# Altium schematic sheet LoopDriver.SchDoc
size B; CompanyName: Microchip Technology Inc.; Organization: Microchip Technology; Address1: 2355 West Chandler Blvd.; Address2: Chandler, AZ  85224; Address4: USA; SheetNumber: 2; SheetTotal: 4; SheetTitle: **; Time: Time
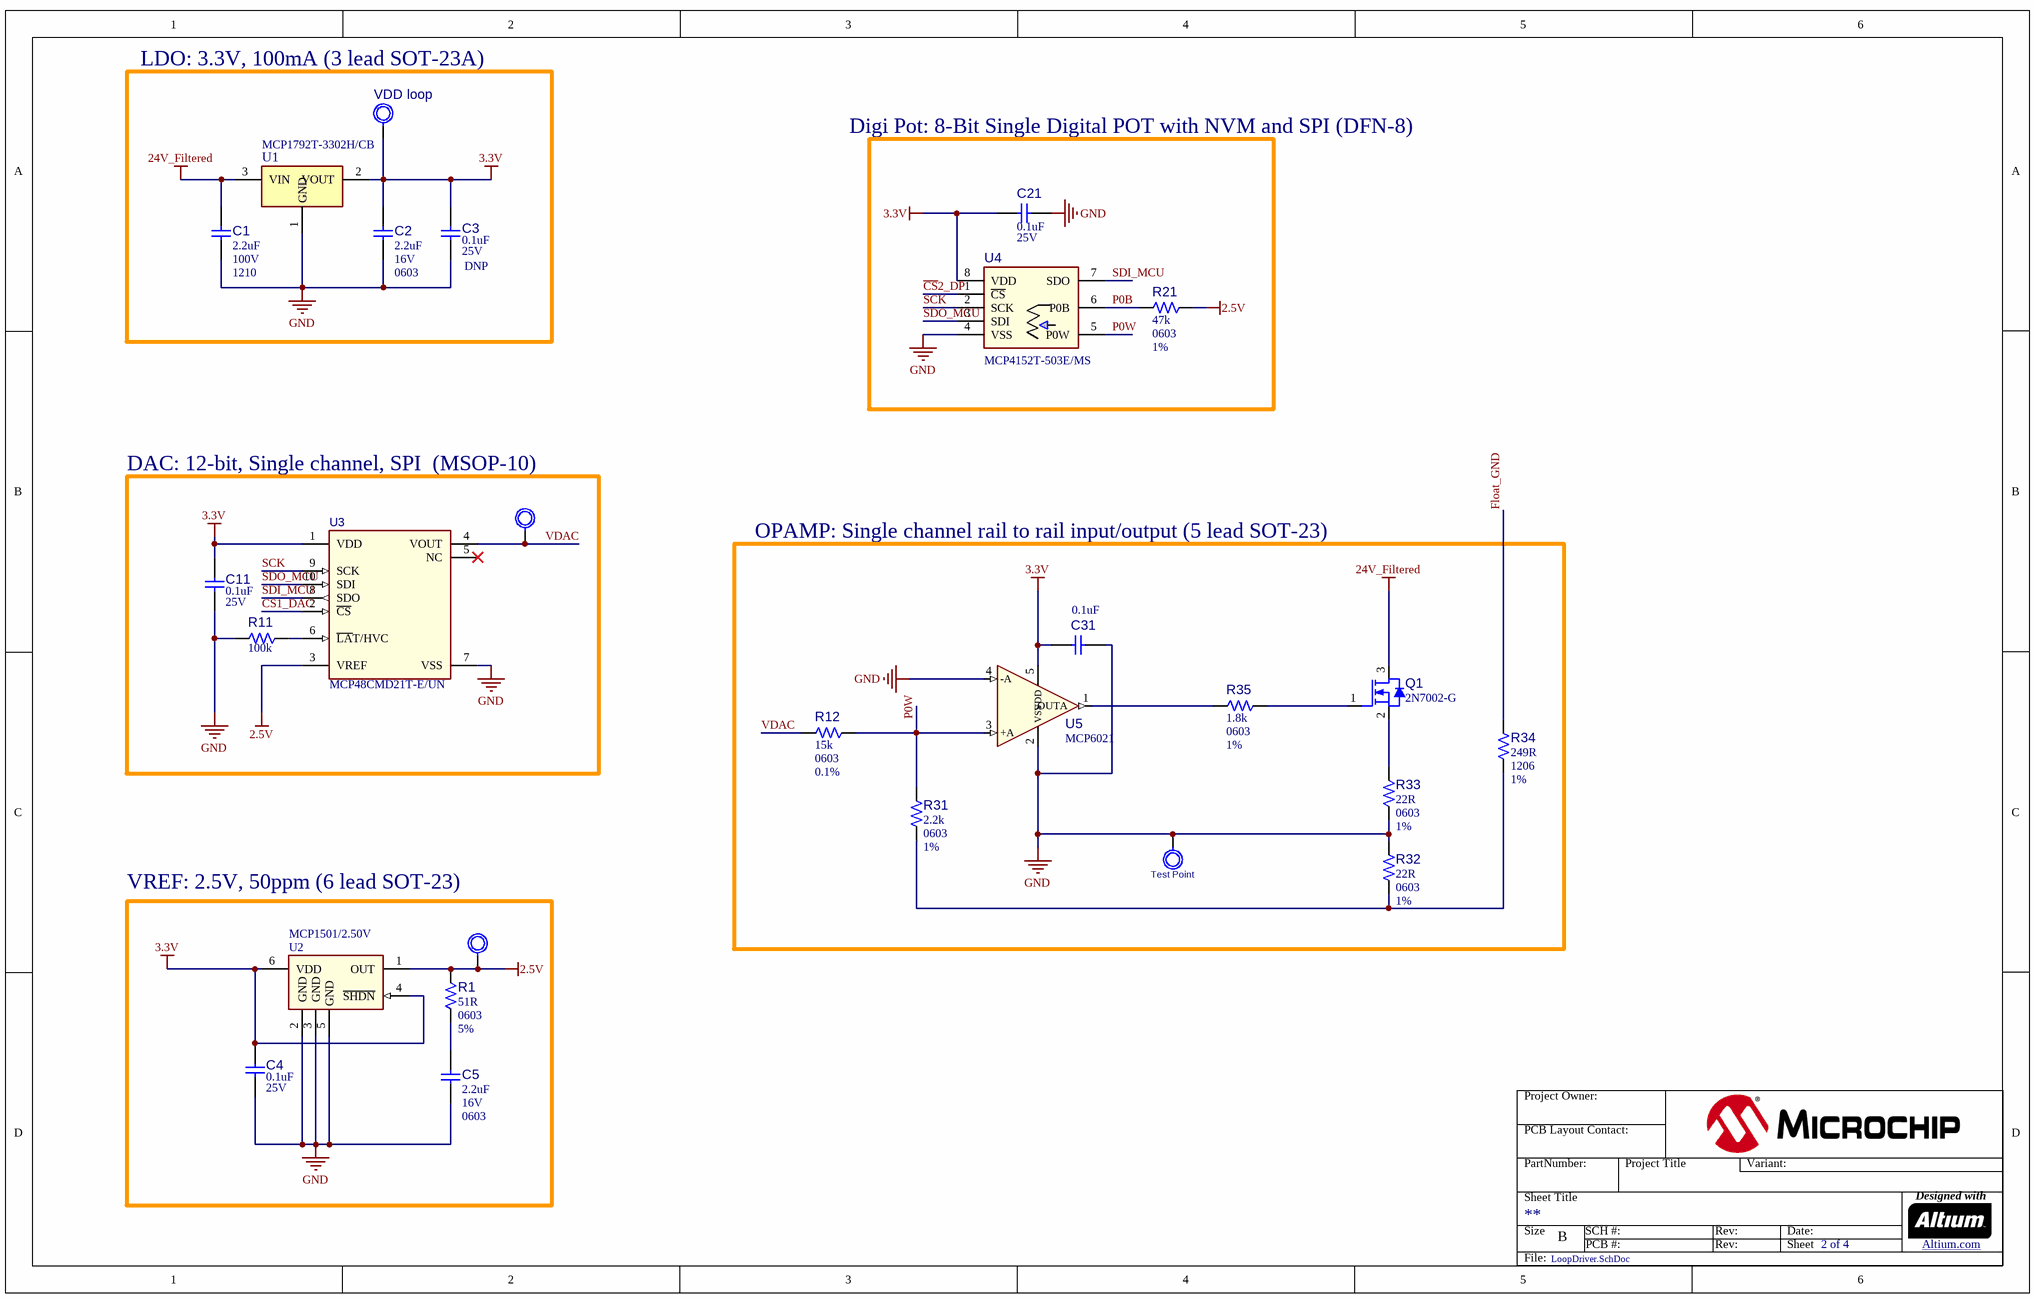
[diagram p0: LoopDriver.SchDoc]

## Parts
C1  value 2.2uF  Voltage: 100V  Package: 1210  [CAP_C_1210]
C2  value 2.2uF  Voltage: 16V  Package: 0603  [CAP_C_0603]
C3  value 0.1uF  Voltage: 25V  Populated: DNP  [CAP_C_0603]
C4  value 0.1uF  Voltage: 25V  [CAP_C_0603]
C5  value 2.2uF  Voltage: 16V  Package: 0603  [CAP_C_0603]
C11  value 0.1uF  Voltage: 25V  [CAP_C_0603]
C21  value 0.1uF  Voltage: 25V  [CAP_C_0603]
C31  value 0.1uF  [CAP_C_0603]
GND  Test Point  [CON_TP_TH_V_BLK_KEC_5011]
Q1  value 2N7002-G  [SOT-23-3]
R1  value 51R  Package: 0603  Tolerance: 5%  [RES_C_0603]
R11  value 100k  [RES_C_0603]
R12  value 15k  Package: 0603  Tolerance: 0.1%  [RES_C_0603]
R21  value 47k  Package: 0603  Tolerance: 1%  [RES_C_0603]
R31  value 2.2k  Package: 0603  Tolerance: 1%  [RES_C_0603]
R32  value 22R  Package: 0603  Tolerance: 1%  [RES_C_0603]
R33  value 22R  Package: 0603  Tolerance: 1%  [RES_C_0603]
R34  value 249R  Package: 1206  Tolerance: 1%  [RES_C_1206]
R35  value 1.8k  Package: 0603  Tolerance: 1%  [RES_C_0603]
U1  value MCP1792T-3302H/CB  [SOT-23A-3]
U2  value MCP1501/2.50V  [SOT-23-6]
U3  value MCP48CMD21T-E/UN  [MSOP-10]
U4  value MCP4152T-503E/MS  [MSOP-8]
U5  value MCP6021  [SOT-23-5]
VDAC  (no value)  [CON_TP_TH_V_RED_KEC_5010]
VDD_loop  (no value)  [CON_TP_TH_V_RED_KEC_5010]
VREF  (no value)  [CON_TP_TH_V_RED_KEC_5010]

## Nets
2.5V: R1.2 R21.1 U2.1(OUT) U3.3(VREF) VREF.1
3.3V: C2.2 C3.2 C4.1 C11.1 C21.2 C31.1 U1.2(VOUT) U2.4(~{SHDN}) U2.6(VDD) U3.1(VDD) U4.8(VDD) U5.5(VDD) VDD_loop.1
24V_Filtered: C1.2 Q1.3(D) U1.3(VIN)
GND: C1.1 C2.1 C3.1 C4.2 C5.1 C11.2 C21.1 C31.2 GND.1 R11.1 R32.2 R33.1 U1.1(GND) U2.2(GND) U2.3(GND) U2.5(GND) U3.7(VSS) U4.4(VSS) U5.2(VSS) U5.4(-A)
~{CS}1_DAC: U3.2(~{CS})
~{CS}2_DP: U4.1(~{CS})
Float_GND: R34.2
P0B: R21.2 U4.6(P0B)
P0W: R12.2 R31.2 U4.5(P0W) U5.3(+A)
SCK: U3.9(SCK) U4.2(SCK)
SDI_MCU: U3.8(SDO) U4.7(SDO)
SDO_MCU: U3.10(SDI) U4.3(SDI)
VDAC: R12.1 U3.4(VOUT) VDAC.1
NetC5_2: C5.2 R1.1
NetQ1_1: Q1.1(G) R35.2
NetQ1_2: Q1.2(S) R33.2
NetR11_2: R11.2 U3.6(~{LA}T/HVC)
NetR31_1: R31.1 R32.1 R34.1
NetR35_1: R35.1 U5.1(OUTA)

Not connected (* = marked no-connect by the designer): U3 5(NC)*

## Notes on the sheet
- LDO: 3.3V, 100mA (3 lead SOT-23A)
- Digi Pot: 8-Bit Single Digital POT with NVM and SPI (DFN-8)
- DAC: 12-bit, Single channel, SPI  (MSOP-10)
- OPAMP: Single channel rail to rail input/output (5 lead SOT-23)
- VREF: 2.5V, 50ppm (6 lead SOT-23)
- Project Owner:
- PCB Layout Contact:
- PartNumber:
- Project Title
- Variant:
- Sheet Title
- Size
- B
- SCH #:
- PCB #:
- Rev:
- Date:
- Sheet
- Designed with
- Altium.com <http://go.altium.com/MicrochipLandingPage_Evaluation.html>
- File:

## Library data of the parts
C1 = CAP2314: Manufacturer 1: Samsung Electro-Mechanics; Manufacturer Part Number 1: CL32B225KCJSNNE; Description_: CAP CER 2.2uF 100V 10% X7R SMD 1210; Dev Tools Status: Production; Tolerance: 10%; Temperature Coefficient: X7R; Type: Ceramic; Owner: Narasimha Murthy; Populated: YES; MCHP-ID: CAP2314; Revision: 3; Symbol: Capacitor NP; Status: MCL Design; ComponentLink1URL: https://chn-vm-apps.microchip.com/mchprepo/parts/Datasheets/CL_Series_MLCC_ds.pdf; ComponentLink1Description: SVN Datasheet; ComponentLink2URL: C:\ALTIUM_WORK\00001_MCHP-CDB\Datasheets\CL_Series_MLCC_ds.pdf; ComponentLink2Description: Local Datasheet; ComponentLink3URL: C:\ALTIUM_WORK\00001_MCHP-CDB\Library\LibraryRefs\Capacitor NP.SchLib; ComponentLink3Description: Open Symbol; ComponentLink4URL: C:\ALTIUM_WORK\00001_MCHP-CDB\Library\Footprints\CAP_C_1210.PcbLib; ComponentLink4Description: Open Footprint; ComponentLink5Description: Open Footprint 2; ComponentLink6Description: Open Footprint 3; ComponentLink7Description: Open Footprint 4; Operating Temperature: -55C to +125C; Category: Capacitor; Manufacturer 2: TDK Corporation; Manufacturer Part Number 2: C3225X7R2A225K230AB; Supplier 1: Digi-Key; Supplier Part Number 1: 1276-3362-1-ND; Supplier 2: Digi-Key; Supplier Part Number 2: 445-4497-1-ND; Quantity Override: 1
C2 C5 = CAP0597: Manufacturer 1: TDK Corporation; Manufacturer Part Number 1: C1608X5R1C225K080AB; Description_: CAP CER 2.2uF 16V 10% X5R SMD 0603; Dev Tools Status: Production; Tolerance: 10%; Temperature Coefficient: X5R; Type: Ceramic; Populated: Yes; MCHP-ID: CAP0597; Revision: 6; Symbol: Capacitor NP; Status: MCL Design; ComponentLink1URL: https://chn-vm-apps.microchip.com/mchprepo/parts/Datasheets/general_B11.pdf; ComponentLink1Description: SVN Datasheet; ComponentLink2URL: C:\ALTIUM_WORK\00001_MCHP-CDB\Datasheets\general_B11.pdf; ComponentLink2Description: Local Datasheet; ComponentLink3URL: C:\ALTIUM_WORK\00001_MCHP-CDB\Library\LibraryRefs\Capacitor NP.SchLib; ComponentLink3Description: Open Symbol; ComponentLink4URL: C:\ALTIUM_WORK\00001_MCHP-CDB\Library\Footprints\CAP_C_0603.PcbLib; ComponentLink4Description: Open Footprint; ComponentLink5Description: Open Footprint 2; ComponentLink6Description: Open Footprint 3; ComponentLink7Description: Open Footprint 4; Operating Temperature: -55C to +85C; Category: Capacitor; Supplier 1: Digi-Key; Supplier Part Number 1: 445-5157-1-ND; Quantity Override: 1
C3 = CAP2605: Manufacturer 1: KEMET; Manufacturer Part Number 1: C0603C104K3RAC7013; Description_: CAP CER 0.1uF 25V 10% X7R SMD 0603; Dev Tools Status: Production; Tolerance: 10%; Type: Ceramic; Owner: Cristina Salanti; Temperature Coefficient: X7R; Restricted Sourcing: No; MCHP-ID: CAP2605; Package: 0603; Revision: 1; Symbol: Capacitor NP; Status: MCL Design; ComponentLink1URL: https://chn-vm-apps.microchip.com/mchprepo/parts/Datasheets/KEM_C1002_X7R_SMD.pdf; ComponentLink1Description: SVN Datasheet; ComponentLink2URL: C:\ALTIUM_WORK\00001_MCHP-CDB\Datasheets\KEM_C1002_X7R_SMD.pdf; ComponentLink2Description: Local Datasheet; ComponentLink3URL: C:\ALTIUM_WORK\00001_MCHP-CDB\Library\LibraryRefs\Capacitor NP.SchLib; ComponentLink3Description: Open Symbol; ComponentLink4URL: C:\ALTIUM_WORK\00001_MCHP-CDB\Library\Footprints\CAP_C_0603.PcbLib; ComponentLink4Description: Open Footprint; ComponentLink5Description: Open Footprint 2; ComponentLink6Description: Open Footprint 3; ComponentLink7Description: Open Footprint 4; Operating Temperature: -55C to +125C; Category: Capacitor; Manufacturer 2: KYOCERA AVX; Manufacturer Part Number 2: 06033C104KAZ2A; Manufacturer 3: KYOCERA AVX; Manufacturer Part Number 3: 06033C104KAT4A; Manufacturer 4: Samsung Electro-Mechanics; Manufacturer Part Number 4: CL10B104KA8NNNC; Supplier 1: Digi-Key; Supplier Part Number 1: 399-17572-2-ND; Supplier 2: Digi-Key; Supplier Part Number 2: 478-3539-2-ND; Supplier 3: Digi-Key; Supplier Part Number 3: 478-7018-2-ND; Supplier 4: Digi-Key; Supplier Part Number 4: 1276-1006-2-ND; Quantity Override: 1; Manufacturer 5: TDK Corporation; Manufacturer Part Number 5: CGA3E2X7R1E104K080AA; Manufacturer 6: Walsin; Manufacturer Part Number 6: 0603B104K250CT; Supplier 5: Digi-Key; Supplier Part Number 5: 445-5667-2-ND; Supplier 6: Digi-Key; Supplier Part Number 6: 1292-1642-2-ND
C4 C11 C21 = CAP2605: Manufacturer 1: KEMET; Manufacturer Part Number 1: C0603C104K3RAC7013; Description_: CAP CER 0.1uF 25V 10% X7R SMD 0603; Dev Tools Status: Production; Tolerance: 10%; Type: Ceramic; Owner: Cristina Salanti; Populated: YES; Temperature Coefficient: X7R; Restricted Sourcing: No; MCHP-ID: CAP2605; Package: 0603; Revision: 1; Symbol: Capacitor NP; Status: MCL Design; ComponentLink1URL: https://chn-vm-apps.microchip.com/mchprepo/parts/Datasheets/KEM_C1002_X7R_SMD.pdf; ComponentLink1Description: SVN Datasheet; ComponentLink2URL: C:\ALTIUM_WORK\00001_MCHP-CDB\Datasheets\KEM_C1002_X7R_SMD.pdf; ComponentLink2Description: Local Datasheet; ComponentLink3URL: C:\ALTIUM_WORK\00001_MCHP-CDB\Library\LibraryRefs\Capacitor NP.SchLib; ComponentLink3Description: Open Symbol; ComponentLink4URL: C:\ALTIUM_WORK\00001_MCHP-CDB\Library\Footprints\CAP_C_0603.PcbLib; ComponentLink4Description: Open Footprint; ComponentLink5Description: Open Footprint 2; ComponentLink6Description: Open Footprint 3; ComponentLink7Description: Open Footprint 4; Operating Temperature: -55C to +125C; Category: Capacitor; Manufacturer 2: KYOCERA AVX; Manufacturer Part Number 2: 06033C104KAZ2A; Manufacturer 3: KYOCERA AVX; Manufacturer Part Number 3: 06033C104KAT4A; Manufacturer 4: Samsung Electro-Mechanics; Manufacturer Part Number 4: CL10B104KA8NNNC; Supplier 1: Digi-Key; Supplier Part Number 1: 399-17572-2-ND; Supplier 2: Digi-Key; Supplier Part Number 2: 478-3539-2-ND; Supplier 3: Digi-Key; Supplier Part Number 3: 478-7018-2-ND; Supplier 4: Digi-Key; Supplier Part Number 4: 1276-1006-2-ND; Quantity Override: 1; Manufacturer 5: TDK Corporation; Manufacturer Part Number 5: CGA3E2X7R1E104K080AA; Manufacturer 6: Walsin; Manufacturer Part Number 6: 0603B104K250CT; Supplier 5: Digi-Key; Supplier Part Number 5: 445-5667-2-ND; Supplier 6: Digi-Key; Supplier Part Number 6: 1292-1642-2-ND
C31 = CAP2605: Manufacturer 1: KEMET; Manufacturer Part Number 1: C0603C104K3RAC7013; Voltage: 25V; Description_: CAP CER 0.1uF 25V 10% X7R SMD 0603; Dev Tools Status: Production; Tolerance: 10%; Type: Ceramic; Owner: Cristina Salanti; Populated: YES; Temperature Coefficient: X7R; Restricted Sourcing: No; MCHP-ID: CAP2605; Package: 0603; Revision: 1; Symbol: Capacitor NP; Status: MCL Design; ComponentLink1URL: https://chn-vm-apps.microchip.com/mchprepo/parts/Datasheets/KEM_C1002_X7R_SMD.pdf; ComponentLink1Description: SVN Datasheet; ComponentLink2URL: C:\ALTIUM_WORK\00001_MCHP-CDB\Datasheets\KEM_C1002_X7R_SMD.pdf; ComponentLink2Description: Local Datasheet; ComponentLink3URL: C:\ALTIUM_WORK\00001_MCHP-CDB\Library\LibraryRefs\Capacitor NP.SchLib; ComponentLink3Description: Open Symbol; ComponentLink4URL: C:\ALTIUM_WORK\00001_MCHP-CDB\Library\Footprints\CAP_C_0603.PcbLib; ComponentLink4Description: Open Footprint; ComponentLink5Description: Open Footprint 2; ComponentLink6Description: Open Footprint 3; ComponentLink7Description: Open Footprint 4; Operating Temperature: -55C to +125C; Category: Capacitor; Manufacturer 2: KYOCERA AVX; Manufacturer Part Number 2: 06033C104KAZ2A; Manufacturer 3: KYOCERA AVX; Manufacturer Part Number 3: 06033C104KAT4A; Manufacturer 4: Samsung Electro-Mechanics; Manufacturer Part Number 4: CL10B104KA8NNNC; Supplier 1: Digi-Key; Supplier Part Number 1: 399-17572-2-ND; Supplier 2: Digi-Key; Supplier Part Number 2: 478-3539-2-ND; Supplier 3: Digi-Key; Supplier Part Number 3: 478-7018-2-ND; Supplier 4: Digi-Key; Supplier Part Number 4: 1276-1006-2-ND; Quantity Override: 1; Manufacturer 5: TDK Corporation; Manufacturer Part Number 5: CGA3E2X7R1E104K080AA; Manufacturer 6: Walsin; Manufacturer Part Number 6: 0603B104K250CT; Supplier 5: Digi-Key; Supplier Part Number 5: 445-5667-2-ND; Supplier 6: Digi-Key; Supplier Part Number 6: 1292-1642-2-ND
GND = MISC0025: Manufacturer 1: Keystone; Manufacturer Part Number 1: 5011; Value: TP LOOP Black TH; Description_: CON TP LOOP Black TH; Dev Tools Status: Production; Owner: Tad Ahlvers; Populated: YES; Restricted Sourcing: No; MCHP-ID: MISC0025; Revision: 3; Symbol: Test Point; Status: MCL Design; ComponentLink1URL: https://chn-vm-apps.microchip.com/mchprepo/parts/Datasheets/M60-2p60.pdf; ComponentLink1Description: SVN Datasheet; ComponentLink2URL: C:\ALTIUM_WORK\00001_MCHP-CDB\Datasheets\M60-2p60.pdf; ComponentLink2Description: Local Datasheet; ComponentLink3URL: C:\ALTIUM_WORK\00001_MCHP-CDB\Library\LibraryRefs\Test Point.SchLib; ComponentLink3Description: Open Symbol; ComponentLink4URL: C:\ALTIUM_WORK\00001_MCHP-CDB\Library\Footprints\CON_TP_TH_V_BLK_KEC_5011.PcbLib; ComponentLink4Description: Open Footprint; ComponentLink5Description: Open Footprint 2; ComponentLink6Description: Open Footprint 3; ComponentLink7Description: Open Footprint 4; Type: Test Point; Category: Connector; Manufacturer 2: FuZhou XiXiang Electronic Technology; Manufacturer Part Number 2: Test Point-1P-DIP-H8.1-Ф3.2-BLACK; Supplier 1: Digi-Key; Supplier Part Number 1: 36-5011-ND; Supplier 2: FuZhou XiXiang Electronic Technology; Supplier Part Number 2: Test Point-1P-DIP-H8.1-Ф3.2-BLACK; Quantity Override: 1
Q1 = MIC7247: Transistor MOS; Manufacturer 1: Microchip Technology; Description_: MCHP ANALOG MOSFET N-CH 2N7002-G 60V 115mA SOT-23-3; Type: MOSFET; Dev Tools Status: Production; Owner: Mark Loper; Populated: YES; MCHP-ID: MIC7247; Symbol: Transistor MOS-N GSD; Status: MCL Design; Revision: 2; Category: MCHP-Analog; ComponentLink1URL: https://chn-vm-apps.microchip.com/mchprepo/parts/Datasheets/2N7002.pdf; ComponentLink1Description: SVN Datasheet; ComponentLink2URL: C:\ALTIUM_WORK\00001_MCHP-CDB\Datasheets\2N7002.pdf; ComponentLink2Description: Local Datasheet; ComponentLink3URL: C:\ALTIUM_WORK\00001_MCHP-CDB\Library\LibraryRefs\Transistor MOS-N GSD.SchLib; ComponentLink3Description: Open Symbol; ComponentLink4URL: C:\ALTIUM_WORK\00001_MCHP-CDB\Library\Footprints\SOT-23-3.PcbLib; ComponentLink4Description: Open Footprint; ComponentLink5Description: Open Footprint 2; ComponentLink6Description: Open Footprint 3; ComponentLink7Description: Open Footprint 4; Manufacturer Part Number 1: 2N7002-G; Supplier 1: Digi-Key; Supplier Part Number 1: 2N7002-GMCCT-ND; Operating Temperature: -55C to +150C; Quantity Override: 1
R1 = RSMT0347: Resistor; Manufacturer 1: Panasonic; Manufacturer Part Number 1: ERJ-3GEYJ510V; Description_: RES TKF 51R 5% 1/10W SMD 0603; Dev Tools Status: Production; Temperature Coefficient: 200ppm/C; Power: 1/10W; Populated: Yes; MCHP-ID: RSMT0347; Revision: 1; Symbol: Resistor; Status: MCL Design; ComponentLink1URL: https://chn-vm-apps.microchip.com/mchprepo/parts/Datasheets/nrc.pdf; ComponentLink1Description: SVN Datasheet; ComponentLink2URL: C:\ALTIUM_WORK\00001_MCHP-CDB\Datasheets\nrc.pdf; ComponentLink2Description: Local Datasheet; ComponentLink3URL: C:\ALTIUM_WORK\00001_MCHP-CDB\Library\LibraryRefs\Resistor.SchLib; ComponentLink3Description: Open Symbol; ComponentLink4URL: C:\ALTIUM_WORK\00001_MCHP-CDB\Library\Footprints\RES_C_0603.PcbLib; ComponentLink4Description: Open Footprint; ComponentLink5Description: Open Footprint 2; ComponentLink6Description: Open Footprint 3; ComponentLink7Description: Open Footprint 4; Operating Temperature: -55C to +155C; Category: Resistor; Type: RES SMD; Composition: TKF; Manufacturer 2: NIC Components; Manufacturer Part Number 2: NRC06J510TRF; Manufacturer 3: Stackpole Electronics Inc; Manufacturer Part Number 3: RMCF1/16515%R; Supplier 1: Digi-Key; Supplier Part Number 1: P51GCT-ND; Supplier 2: NIC Components; Supplier Part Number 2: NRC06J510TRF; Supplier 3: Stackpole Electronics Inc; Supplier Part Number 3: RMCF1/16515%R; Quantity Override: 1
R11 = RSMT0026: Resistor; Manufacturer 1: Panasonic; Manufacturer Part Number 1: ERJ-3GEYJ104V; Tolerance: 5%; Description_: RES TKF 100k 5% 1/10W SMD 0603 AEC-Q200; Dev Tools Status: Production; Voltage: 75V; Power: 1/10W; Populated: Yes; Temperature Coefficient: 200ppm/C; MCHP-ID: RSMT0026; Package: 0603; Revision: 3; Symbol: Resistor; Status: MCL Design; ComponentLink1URL: https://chn-vm-apps.microchip.com/mchprepo/parts/Datasheets/AOA0000CE1.pdf; ComponentLink1Description: SVN Datasheet; ComponentLink2URL: C:\ALTIUM_WORK\00001_MCHP-CDB\Datasheets\AOA0000CE1.pdf; ComponentLink2Description: Local Datasheet; ComponentLink3URL: C:\ALTIUM_WORK\00001_MCHP-CDB\Library\LibraryRefs\Resistor.SchLib; ComponentLink3Description: Open Symbol; ComponentLink4URL: C:\ALTIUM_WORK\00001_MCHP-CDB\Library\Footprints\RES_C_0603.PcbLib; ComponentLink4Description: Open Footprint; ComponentLink5Description: Open Footprint 2; ComponentLink6Description: Open Footprint 3; ComponentLink7Description: Open Footprint 4; Operating Temperature: -55C to +155C; Category: Resistor; Type: RES SMD; Composition: TKF; Supplier 1: Digi-Key; Supplier Part Number 1: P100KGTR-ND; Quantity Override: 1; Manufacturer 2: Panasonic; Manufacturer Part Number 2: ERJ-3GSYJ104V; Manufacturer 3: ROHM; Manufacturer Part Number 3: MCR03EZPJ104; Manufacturer 4: Stackpole Electronics Inc; Manufacturer Part Number 4: RMCF0603JT100K; Manufacturer 5: KOA Speer; Manufacturer Part Number 5: RK73B1JTTD104J; Supplier 2: Digi-Key; Supplier Part Number 2: RHM100KGTR-ND; Supplier 3: Digi-Key; Supplier Part Number 3: RMCF0603JT100KTR-ND; Supplier 4: KOA Speer; Supplier Part Number 4: RK73B1JTTD104J
R12 = RES1598: Resistor; Manufacturer 1: Panasonic Electronic Components                                                                               Panasonic Electronic Components; Manufacturer Part Number 1: ERA-3AEB153V; Description_: RES TF 15k 0.1% 1/10W SMD 0603; Dev Tools Status: Production; Temperature Coefficient: ±25ppm/°C; Power: 0.1W, 1/10W; Owner: Jose Garcia; Populated: YES; MCHP-ID: RES1598; Revision: 2; Symbol: Resistor; Status: MCL Design; ComponentLink1Description: SVN Datasheet; ComponentLink2Description: Local Datasheet; ComponentLink3URL: C:\ALTIUM_WORK\00001_MCHP-CDB\Library\LibraryRefs\Resistor.SchLib; ComponentLink3Description: Open Symbol; ComponentLink4URL: C:\ALTIUM_WORK\00001_MCHP-CDB\Library\Footprints\RES_C_0603.PcbLib; ComponentLink4Description: Open Footprint; ComponentLink5Description: Open Footprint 2; ComponentLink6Description: Open Footprint 3; ComponentLink7Description: Open Footprint 4; Operating Temperature: -55°C ~ 155°C; Category: Resistor; Type: RES SMD; Composition: TF; Supplier 1: Digi-Key; Supplier Part Number 1: P15KDBCT-ND; Quantity Override: 1
R21 = RES1183: Resistor; Manufacturer 1: Panasonic; Manufacturer Part Number 1: ERJ-3EKF4702V; Description_: RES TKF 47k 1% 1/10W SMD 0603; Dev Tools Status: Production; Voltage: 75V; Temperature Coefficient: 100ppm/C; Power: 1/10W; Owner: Adrian M (M91404); Populated: YES; MCHP-ID: RES1183; Revision: 0; Symbol: Resistor; Status: MCL Design; ComponentLink1URL: https://chn-vm-apps.microchip.com/mchprepo/parts/Datasheets/AOA0000CE2.pdf; ComponentLink1Description: SVN Datasheet; ComponentLink2URL: C:\ALTIUM_WORK\00001_MCHP-CDB\Datasheets\AOA0000CE2.pdf; ComponentLink2Description: Local Datasheet; ComponentLink3URL: C:\ALTIUM_WORK\00001_MCHP-CDB\Library\LibraryRefs\Resistor.SchLib; ComponentLink3Description: Open Symbol; ComponentLink4URL: C:\ALTIUM_WORK\00001_MCHP-CDB\Library\Footprints\RES_C_0603.PcbLib; ComponentLink4Description: Open Footprint; ComponentLink5Description: Open Footprint 2; ComponentLink6Description: Open Footprint 3; ComponentLink7Description: Open Footprint 4; Operating Temperature: -55C to +155C; Category: Resistor; Type: RES SMD; Composition: TKF; Supplier 1: Digi-Key; Supplier Part Number 1: P47.0KHCT-ND; Quantity Override: 1
R31 = RES1130: Resistor; Manufacturer 1: Panasonic; Manufacturer Part Number 1: ERJ-3EKF2201V; Description_: RES TKF 2.2k 1% 1/10W SMD 0603; Dev Tools Status: Production; Voltage: 75V; Temperature Coefficient: 100ppm/C; Power: 1/10W; Owner: Bogdan P (M91398); Populated: Yes; MCHP-ID: RES1130; Revision: 0; Symbol: Resistor; Status: MCL Design; ComponentLink1URL: https://chn-vm-apps.microchip.com/mchprepo/parts/Datasheets/AOA0000CE2.pdf; ComponentLink1Description: SVN Datasheet; ComponentLink2URL: C:\ALTIUM_WORK\00001_MCHP-CDB\Datasheets\AOA0000CE2.pdf; ComponentLink2Description: Local Datasheet; ComponentLink3URL: C:\ALTIUM_WORK\00001_MCHP-CDB\Library\LibraryRefs\Resistor.SchLib; ComponentLink3Description: Open Symbol; ComponentLink4URL: C:\ALTIUM_WORK\00001_MCHP-CDB\Library\Footprints\RES_C_0603.PcbLib; ComponentLink4Description: Open Footprint; ComponentLink5Description: Open Footprint 2; ComponentLink6Description: Open Footprint 3; ComponentLink7Description: Open Footprint 4; Operating Temperature: -55C to +155C; Category: Resistor; Type: RES SMD; Composition: TKF; Supplier 1: Digi-Key; Supplier Part Number 1: P2.20KHCT-ND; Quantity Override: 1
R32 R33 = RES1560: Resistor; Manufacturer 1: Panasonic Electronic Components; Manufacturer Part Number 1: ERJ-3EKF22R0V; Description_: RES TKF 22R 1% 1/10W SMD 0603; Dev Tools Status: Production; Voltage: 75V; Temperature Coefficient: 100ppm/C; Power: 1/10W; Populated: YES; MCHP-ID: RES1560; Revision: 1; Symbol: Resistor; Status: MCL Design; ComponentLink1URL: https://chn-vm-apps.microchip.com/mchprepo/parts/Datasheets/AOA0000CE2.pdf; ComponentLink1Description: SVN Datasheet; ComponentLink2URL: C:\ALTIUM_WORK\00001_MCHP-CDB\Datasheets\AOA0000CE2.pdf; ComponentLink2Description: Local Datasheet; ComponentLink3URL: C:\ALTIUM_WORK\00001_MCHP-CDB\Library\LibraryRefs\Resistor.SchLib; ComponentLink3Description: Open Symbol; ComponentLink4URL: C:\ALTIUM_WORK\00001_MCHP-CDB\Library\Footprints\RES_C_0603.PcbLib; ComponentLink4Description: Open Footprint; ComponentLink5Description: Open Footprint 2; ComponentLink6Description: Open Footprint 3; ComponentLink7Description: Open Footprint 4; Operating Temperature: -55C to +155C; Category: Resistor; Type: RES SMD; Composition: TKF; Supplier 1: Digi-Key; Supplier Part Number 1: P22.0HCT-ND; Quantity Override: 1
R34 = RSMT0390: Resistor; Manufacturer 1: ROHM; Manufacturer Part Number 1: MCR18EZHF2490; Description_: RES TKF 249R 1% 1/4W SMD 1206; Dev Tools Status: Production; Voltage: 200V; Temperature Coefficient: 100ppm/C; Power: 1/4W; Populated: Yes; MCHP-ID: RSMT0390; Revision: 1; Symbol: Resistor; Status: MCL Design; ComponentLink1URL: https://chn-vm-apps.microchip.com/mchprepo/parts/Datasheets/MCR18_Thick_Film_Rectangular_Series.pdf; ComponentLink1Description: SVN Datasheet; ComponentLink2URL: C:\ALTIUM_WORK\00001_MCHP-CDB\Datasheets\MCR18_Thick_Film_Rectangular_Series.pdf; ComponentLink2Description: Local Datasheet; ComponentLink3URL: C:\ALTIUM_WORK\00001_MCHP-CDB\Library\LibraryRefs\Resistor.SchLib; ComponentLink3Description: Open Symbol; ComponentLink4URL: C:\ALTIUM_WORK\00001_MCHP-CDB\Library\Footprints\RES_C_1206.PcbLib; ComponentLink4Description: Open Footprint; ComponentLink5Description: Open Footprint 2; ComponentLink6Description: Open Footprint 3; ComponentLink7Description: Open Footprint 4; Operating Temperature: -55C to +155C; Category: Resistor; Type: RES SMD; Composition: TKF; Supplier 1: Digi-Key; Supplier Part Number 1: RHM249FCT-ND; Quantity Override: 1
R35 = RES1110: Resistor; Manufacturer 1: Panasonic; Manufacturer Part Number 1: ERJ-3EKF1801V; Description_: RES TKF 1.8k 1% 1/10W SMD 0603; Dev Tools Status: Production; Voltage: 75V; Temperature Coefficient: 100ppm/C; Power: 1/10W; Owner: Bogdan P (M91398); Populated: Yes; MCHP-ID: RES1110; Revision: 0; Symbol: Resistor; Status: MCL Design; ComponentLink1URL: https://chn-vm-apps.microchip.com/mchprepo/parts/Datasheets/AOA0000CE2.pdf; ComponentLink1Description: SVN Datasheet; ComponentLink2URL: C:\ALTIUM_WORK\00001_MCHP-CDB\Datasheets\AOA0000CE2.pdf; ComponentLink2Description: Local Datasheet; ComponentLink3URL: C:\ALTIUM_WORK\00001_MCHP-CDB\Library\LibraryRefs\Resistor.SchLib; ComponentLink3Description: Open Symbol; ComponentLink4URL: C:\ALTIUM_WORK\00001_MCHP-CDB\Library\Footprints\RES_C_0603.PcbLib; ComponentLink4Description: Open Footprint; ComponentLink5Description: Open Footprint 2; ComponentLink6Description: Open Footprint 3; ComponentLink7Description: Open Footprint 4; Operating Temperature: -55C to +155C; Category: Resistor; Type: RES SMD; Composition: TKF; Supplier 1: Digi-Key; Supplier Part Number 1: P1.80KHCT-ND; Quantity Override: 1
U1 = MIC9136: LDO; Manufacturer 1: Microchip Production; Description_: MCHP ANALOG VOLTAGE REGULATOR  3.3V 3LD MCP1792T-3302H/CB SOT-23A-3; Dev Tools Status: Design; Owner: Cristina Salanti; Populated: YES; MCHP-ID: MIC9136; Symbol: MCP1754S SOT-23A-3; Type: Voltage Regulator; Status: MCL Design; Revision: 1; Category: MCHP-Analog; ComponentLink1URL: https://chn-vm-apps.microchip.com/mchprepo/parts/Datasheets/MCP1792-Family-Data-Sheet-DS20006229C.pdf; ComponentLink1Description: SVN Datasheet; ComponentLink2Description: Local Datasheet; ComponentLink3URL: C:\ALTIUM_WORK\00001_MCHP-CDB\Library\LibraryRefs\MCP1754S SOT-23A-3.SchLib; ComponentLink3Description: Open Symbol; ComponentLink4URL: C:\ALTIUM_WORK\00001_MCHP-CDB\Library\Footprints\SOT-23A-3.PcbLib; ComponentLink4Description: Open Footprint; ComponentLink5Description: Open Footprint 2; ComponentLink6Description: Open Footprint 3; ComponentLink7Description: Open Footprint 4; Manufacturer Part Number 1: MIC9136; Supplier 1: Microchip Production; Supplier Part Number 1: MIC9136; Quantity Override: 1; ComponentLink2URL: C:\ALTIUM_WORK\00001_MCHP-CDB\Datasheets\MCP1792-Family-Data-Sheet-DS20006229C.pdf
U2 = MIC9451: High-Precision Buffered Voltage Reference; Manufacturer 1: Microchip Technology; Manufacturer Part Number 1: MCP1501T-25E/CHY; Description_: MCHP ANALOG VREF 2.50V MCP1501T-25E/CHY SOT-23-6; Dev Tools Status: Production; Owner: Jose Garcia; Populated: YES; MCHP-ID: MIC9451; Symbol: MCP1501 SOT-23-6; Type: VREF; Status: MCL Design; Revision: 2; Category: MCHP-Analog; ComponentLink1URL: https://chn-vm-apps.microchip.com/mchprepo/parts/Datasheets/https://ww1.microchip.com/downloads/en/DeviceDoc/20005474E.pdf; ComponentLink1Description: SVN Datasheet; ComponentLink2URL: C:\ALTIUM_WORK\00001_MCHP-CDB\Datasheets\https://ww1.microchip.com/downloads/en/DeviceDoc/20005474E.pdf; ComponentLink2Description: Local Datasheet; ComponentLink3URL: C:\ALTIUM_WORK\00001_MCHP-CDB\Library\LibraryRefs\MCP1501 SOT-23-6.SchLib; ComponentLink3Description: Open Symbol; ComponentLink4URL: C:\ALTIUM_WORK\00001_MCHP-CDB\Library\Footprints\SOT-23-6.PcbLib; ComponentLink4Description: Open Footprint; ComponentLink5Description: Open Footprint 2; ComponentLink6Description: Open Footprint 3; ComponentLink7Description: Open Footprint 4; Supplier 1: Digi-Key; Supplier Part Number 1: MCP1501T-25E/CHYTR-ND; Operating Temperature: -40°C ~ 125°C (TA); Quantity Override: 1
U3 = MIC9655: Manufacturer 1: Microchip Technology; Description_: MCHP ANALOG DAC 1-Ch 12-bit MCP48CMD21T-E/UN MSOP-10; Dev Tools Status: Design; Owner: Alexandru Chiser; Populated: YES; MCHP-ID: MIC9655; Symbol: MCP48CXDX1_MSOP-10; Type: DAC; Status: MCL Design; Revision: 1; Category: MCHP-Analog; ComponentLink1URL: https://www.microchip.com/sitesearch/search/Product%20and%20Development%20Tools/MCP48CMD21T-E/UN; ComponentLink1Description: SVN Datasheet; ComponentLink2Description: Local Datasheet; ComponentLink3URL: C:\ALTIUM_WORK\00001_MCHP-CDB\Library\LibraryRefs\MCP48CXDX1_MSOP-10.SchLib; ComponentLink3Description: Open Symbol; ComponentLink4URL: C:\ALTIUM_WORK\00001_MCHP-CDB\Library\Footprints\MSOP-10.PcbLib; ComponentLink4Description: Open Footprint; ComponentLink5Description: Open Footprint 2; ComponentLink6Description: Open Footprint 3; ComponentLink7Description: Open Footprint 4; Manufacturer Part Number 1: MCP48CMD21T-E/UN; Supplier 1: Microchip Technology; Supplier Part Number 1: MCP48CMD21T-E/UN; Operating Temperature: -40C to +125C; Quantity Override: 1
U4 = MIC9715: Manufacturer 1: Microchip Technology; Description_: MCHP ANALOG DIGIPOT 50KOHM 257TAP 8MSOP; Dev Tools Status: Design; Owner: Jose Garcia; Populated: YES; MCHP-ID: MIC9715; Symbol: MCP41X2 SOIC-8_PDIP-8_MSOP-8; Type: Digipot; Status: MCL Design; Revision: 2; Category: MCHP-Analog; ComponentLink1URL: https://chn-vm-apps.microchip.com/mchprepo/parts/Datasheets/22060b.pdf; ComponentLink1Description: SVN Datasheet; ComponentLink2URL: C:\ALTIUM_WORK\00001_MCHP-CDB\Datasheets\22060b.pdf; ComponentLink2Description: Local Datasheet; ComponentLink3URL: C:\ALTIUM_WORK\00001_MCHP-CDB\Library\LibraryRefs\MCP41X2 SOIC-8_PDIP-8_MSOP-8.SchLib; ComponentLink3Description: Open Symbol; ComponentLink4URL: C:\ALTIUM_WORK\00001_MCHP-CDB\Library\Footprints\MSOP-8.PcbLib; ComponentLink4Description: Open Footprint; ComponentLink5Description: Open Footprint 2; ComponentLink6Description: Open Footprint 3; ComponentLink7Description: Open Footprint 4; Manufacturer Part Number 1: MCP4152T-503E/MS; Supplier 1: Digi-Key; Supplier Part Number 1: MCP4152T-503E/MSTR-ND; Operating Temperature: -40°C ~ 125°C; Quantity Override: 1
U5 = MIC0507: OPAMP; Manufacturer 1: Microchip; Manufacturer Part Number 1: MCP6021T-E/OT; Description_: MCHP ANALOG OPAMP 1-Ch 10MHz MCP6021T-E/OT SOT-23-5; Dev Tools Status: Production; Populated: Yes; MCHP-ID: MIC0507; Symbol: MCP6XX1_6 SOT-23-5_SC-70-5; Type: OpAmp; Status: MCL Design; Revision: 1; Category: MCHP-Analog; ComponentLink1URL: https://www.microchip.com/sitesearch/search/Product%20and%20Development%20Tools/MCP6021T-E/OT; ComponentLink1Description: SVN Datasheet; ComponentLink2Description: Local Datasheet; ComponentLink3URL: C:\ALTIUM_WORK\00001_MCHP-CDB\Library\LibraryRefs\MCP6XX1_6 SOT-23-5_SC-70-5.SchLib; ComponentLink3Description: Open Symbol; ComponentLink4URL: C:\ALTIUM_WORK\00001_MCHP-CDB\Library\Footprints\SOT-23-5.PcbLib; ComponentLink4Description: Open Footprint; ComponentLink5Description: Open Footprint 2; ComponentLink6Description: Open Footprint 3; ComponentLink7Description: Open Footprint 4; Supplier 1: Microchip; Supplier Part Number 1: MCP6021T-E/OT; Operating Temperature: -40C to +125C; Quantity Override: 1
VDAC VDD_loop VREF = CON1084: Test Point; Manufacturer 1: Keystone; Manufacturer Part Number 1: 5010; Value: TP LOOP Red; Description_: CON TP LOOP Red TH; Dev Tools Status: Production; Owner: Stephen Humberd; Populated: DNP; MCHP-ID: CON1084; Revision: D; Symbol: Test Point; Status: MCL Design; ComponentLink1URL: https://chn-vm-apps.microchip.com/mchprepo/parts/Datasheets/5010.pdf; ComponentLink1Description: SVN Datasheet; ComponentLink2URL: C:\ALTIUM_WORK\00001_MCHP-CDB\Datasheets\5010.pdf; ComponentLink2Description: Local Datasheet; ComponentLink3URL: C:\ALTIUM_WORK\00001_MCHP-CDB\Library\LibraryRefs\Test Point.SchLib; ComponentLink3Description: Open Symbol; ComponentLink4URL: C:\ALTIUM_WORK\00001_MCHP-CDB\Library\Footprints\CON_TP_TH_V_RED_KEC_5010.PcbLib; ComponentLink4Description: Open Footprint; ComponentLink5Description: Open Footprint 2; ComponentLink6Description: Open Footprint 3; ComponentLink7Description: Open Footprint 4; Type: Test Point; Category: Connector; Manufacturer 2: FuZhou XiXiang; Manufacturer Part Number 2: Test Point-1P-DIP-H4.6-Ø2.5-RED; Manufacturer 3: FuZhou XiXiang; Manufacturer Part Number 3: Test Point-1P-DIP-H8.1-Ø3.2-RED; Supplier 1: Digi-Key; Supplier Part Number 1: 36-5010-ND; Supplier 2: FuZhou XiXiang; Supplier Part Number 2: Test Point-1P-DIP-H4.6-Ø2.5-RED; Supplier 3: FuZhou XiXiang; Supplier Part Number 3: Test Point-1P-DIP-H8.1-Ø3.2-RED; Quantity Override: 1